# Altium schematic sheet LedMatrixPixelArray.SchDoc
size A4
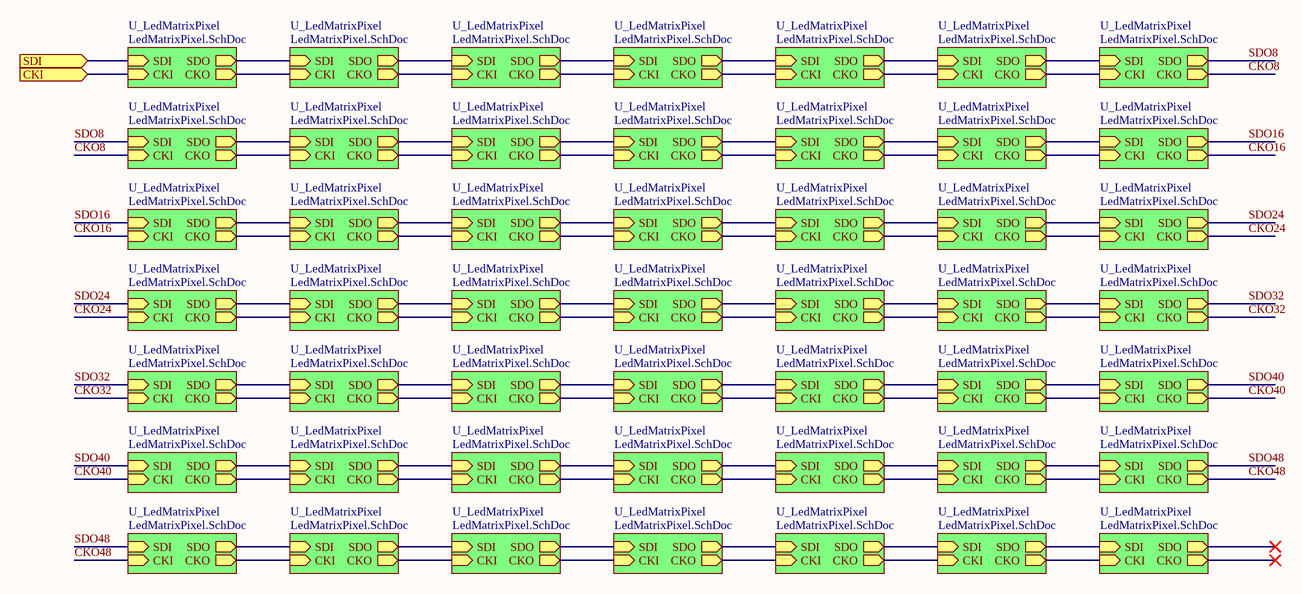
[diagram p0: LedMatrixPixelArray.SchDoc]

## Sub-sheets
U_LedMatrixPixel = LedMatrixPixel.SchDoc: SDI (in), CKI (in), SDO (out), CKO (out)
U_LedMatrixPixel = LedMatrixPixel.SchDoc: SDI (in), CKI (in), SDO (out), CKO (out)
U_LedMatrixPixel = LedMatrixPixel.SchDoc: SDI (in), CKI (in), SDO (out), CKO (out)
U_LedMatrixPixel = LedMatrixPixel.SchDoc: SDI (in), CKI (in), SDO (out), CKO (out)
U_LedMatrixPixel = LedMatrixPixel.SchDoc: SDI (in), CKI (in), SDO (out), CKO (out)
U_LedMatrixPixel = LedMatrixPixel.SchDoc: SDI (in), CKI (in), SDO (out), CKO (out)
U_LedMatrixPixel = LedMatrixPixel.SchDoc: SDI (in), CKI (in), SDO (out), CKO (out)
U_LedMatrixPixel = LedMatrixPixel.SchDoc: SDI (in), CKI (in), SDO (out), CKO (out)
U_LedMatrixPixel = LedMatrixPixel.SchDoc: SDI (in), CKI (in), SDO (out), CKO (out)
U_LedMatrixPixel = LedMatrixPixel.SchDoc: SDI (in), CKI (in), SDO (out), CKO (out)
U_LedMatrixPixel = LedMatrixPixel.SchDoc: SDI (in), CKI (in), SDO (out), CKO (out)
U_LedMatrixPixel = LedMatrixPixel.SchDoc: SDI (in), CKI (in), SDO (out), CKO (out)
U_LedMatrixPixel = LedMatrixPixel.SchDoc: SDI (in), CKI (in), SDO (out), CKO (out)
U_LedMatrixPixel = LedMatrixPixel.SchDoc: SDI (in), CKI (in), SDO (out), CKO (out)
U_LedMatrixPixel = LedMatrixPixel.SchDoc: SDI (in), CKI (in), SDO (out), CKO (out)
U_LedMatrixPixel = LedMatrixPixel.SchDoc: SDI (in), CKI (in), SDO (out), CKO (out)
U_LedMatrixPixel = LedMatrixPixel.SchDoc: SDI (in), CKI (in), SDO (out), CKO (out)
U_LedMatrixPixel = LedMatrixPixel.SchDoc: SDI (in), CKI (in), SDO (out), CKO (out)
U_LedMatrixPixel = LedMatrixPixel.SchDoc: SDI (in), CKI (in), SDO (out), CKO (out)
U_LedMatrixPixel = LedMatrixPixel.SchDoc: SDI (in), CKI (in), SDO (out), CKO (out)
U_LedMatrixPixel = LedMatrixPixel.SchDoc: SDI (in), CKI (in), SDO (out), CKO (out)
U_LedMatrixPixel = LedMatrixPixel.SchDoc: SDI (in), CKI (in), SDO (out), CKO (out)
U_LedMatrixPixel = LedMatrixPixel.SchDoc: SDI (in), CKI (in), SDO (out), CKO (out)
U_LedMatrixPixel = LedMatrixPixel.SchDoc: SDI (in), CKI (in), SDO (out), CKO (out)
U_LedMatrixPixel = LedMatrixPixel.SchDoc: SDI (in), CKI (in), SDO (out), CKO (out)
U_LedMatrixPixel = LedMatrixPixel.SchDoc: SDI (in), CKI (in), SDO (out), CKO (out)
U_LedMatrixPixel = LedMatrixPixel.SchDoc: SDI (in), CKI (in), SDO (out), CKO (out)
U_LedMatrixPixel = LedMatrixPixel.SchDoc: SDI (in), CKI (in), SDO (out), CKO (out)
U_LedMatrixPixel = LedMatrixPixel.SchDoc: SDI (in), CKI (in), SDO (out), CKO (out)
U_LedMatrixPixel = LedMatrixPixel.SchDoc: SDI (in), CKI (in), SDO (out), CKO (out)
U_LedMatrixPixel = LedMatrixPixel.SchDoc: SDI (in), CKI (in), SDO (out), CKO (out)
U_LedMatrixPixel = LedMatrixPixel.SchDoc: SDI (in), CKI (in), SDO (out), CKO (out)
U_LedMatrixPixel = LedMatrixPixel.SchDoc: SDI (in), CKI (in), SDO (out), CKO (out)
U_LedMatrixPixel = LedMatrixPixel.SchDoc: SDI (in), CKI (in), SDO (out), CKO (out)
U_LedMatrixPixel = LedMatrixPixel.SchDoc: SDI (in), CKI (in), SDO (out), CKO (out)
U_LedMatrixPixel = LedMatrixPixel.SchDoc: SDI (in), CKI (in), SDO (out), CKO (out)
U_LedMatrixPixel = LedMatrixPixel.SchDoc: SDI (in), CKI (in), SDO (out), CKO (out)
U_LedMatrixPixel = LedMatrixPixel.SchDoc: SDI (in), CKI (in), SDO (out), CKO (out)
U_LedMatrixPixel = LedMatrixPixel.SchDoc: SDI (in), CKI (in), SDO (out), CKO (out)
U_LedMatrixPixel = LedMatrixPixel.SchDoc: SDI (in), CKI (in), SDO (out), CKO (out)
U_LedMatrixPixel = LedMatrixPixel.SchDoc: SDI (in), CKI (in), SDO (out), CKO (out)
U_LedMatrixPixel = LedMatrixPixel.SchDoc: SDI (in), CKI (in), SDO (out), CKO (out)
U_LedMatrixPixel = LedMatrixPixel.SchDoc: SDI (in), CKI (in), SDO (out), CKO (out)
U_LedMatrixPixel = LedMatrixPixel.SchDoc: SDI (in), CKI (in), SDO (out), CKO (out)
U_LedMatrixPixel = LedMatrixPixel.SchDoc: SDI (in), CKI (in), SDO (out), CKO (out)
U_LedMatrixPixel = LedMatrixPixel.SchDoc: SDI (in), CKI (in), SDO (out), CKO (out)
U_LedMatrixPixel = LedMatrixPixel.SchDoc: SDI (in), CKI (in), SDO (out), CKO (out)
U_LedMatrixPixel = LedMatrixPixel.SchDoc: SDI (in), CKI (in), SDO (out), CKO (out)
U_LedMatrixPixel = LedMatrixPixel.SchDoc: SDI (in), CKI (in), SDO (out), CKO (out)

## Ports
CKI (in), SDI (in)

## Nets
CKI: port CKI, sheet U_LedMatrixPixel/CKI
CKO8: sheet U_LedMatrixPixel/CKI, sheet U_LedMatrixPixel/CKO
CKO16: sheet U_LedMatrixPixel/CKI, sheet U_LedMatrixPixel/CKO
CKO24: sheet U_LedMatrixPixel/CKI, sheet U_LedMatrixPixel/CKO
CKO32: sheet U_LedMatrixPixel/CKI, sheet U_LedMatrixPixel/CKO
CKO40: sheet U_LedMatrixPixel/CKI, sheet U_LedMatrixPixel/CKO
CKO48: sheet U_LedMatrixPixel/CKI, sheet U_LedMatrixPixel/CKO
SDI: port SDI, sheet U_LedMatrixPixel/SDI
SDO8: sheet U_LedMatrixPixel/SDI, sheet U_LedMatrixPixel/SDO
SDO16: sheet U_LedMatrixPixel/SDI, sheet U_LedMatrixPixel/SDO
SDO24: sheet U_LedMatrixPixel/SDI, sheet U_LedMatrixPixel/SDO
SDO32: sheet U_LedMatrixPixel/SDI, sheet U_LedMatrixPixel/SDO
SDO40: sheet U_LedMatrixPixel/SDI, sheet U_LedMatrixPixel/SDO
SDO48: sheet U_LedMatrixPixel/SDI, sheet U_LedMatrixPixel/SDO
(unnamed): sheet U_LedMatrixPixel/SDO, sheet U_LedMatrixPixel/SDI
(unnamed): sheet U_LedMatrixPixel/CKO, sheet U_LedMatrixPixel/CKI
(unnamed): sheet U_LedMatrixPixel/SDO, sheet U_LedMatrixPixel/SDI
(unnamed): sheet U_LedMatrixPixel/CKO, sheet U_LedMatrixPixel/CKI
(unnamed): sheet U_LedMatrixPixel/SDO, sheet U_LedMatrixPixel/SDI
(unnamed): sheet U_LedMatrixPixel/CKO, sheet U_LedMatrixPixel/CKI
(unnamed): sheet U_LedMatrixPixel/SDO, sheet U_LedMatrixPixel/SDI
(unnamed): sheet U_LedMatrixPixel/CKO, sheet U_LedMatrixPixel/CKI
(unnamed): sheet U_LedMatrixPixel/SDO, sheet U_LedMatrixPixel/SDI
(unnamed): sheet U_LedMatrixPixel/CKO, sheet U_LedMatrixPixel/CKI
(unnamed): sheet U_LedMatrixPixel/SDO, sheet U_LedMatrixPixel/SDI
(unnamed): sheet U_LedMatrixPixel/CKO, sheet U_LedMatrixPixel/CKI
(unnamed): sheet U_LedMatrixPixel/SDO, sheet U_LedMatrixPixel/SDI
(unnamed): sheet U_LedMatrixPixel/CKO, sheet U_LedMatrixPixel/CKI
(unnamed): sheet U_LedMatrixPixel/SDO, sheet U_LedMatrixPixel/SDI
(unnamed): sheet U_LedMatrixPixel/CKO, sheet U_LedMatrixPixel/CKI
(unnamed): sheet U_LedMatrixPixel/SDO, sheet U_LedMatrixPixel/SDI
(unnamed): sheet U_LedMatrixPixel/CKO, sheet U_LedMatrixPixel/CKI
(unnamed): sheet U_LedMatrixPixel/SDO, sheet U_LedMatrixPixel/SDI
(unnamed): sheet U_LedMatrixPixel/CKO, sheet U_LedMatrixPixel/CKI
(unnamed): sheet U_LedMatrixPixel/SDO, sheet U_LedMatrixPixel/SDI
(unnamed): sheet U_LedMatrixPixel/CKO, sheet U_LedMatrixPixel/CKI
(unnamed): sheet U_LedMatrixPixel/SDO, sheet U_LedMatrixPixel/SDI
(unnamed): sheet U_LedMatrixPixel/CKO, sheet U_LedMatrixPixel/CKI
(unnamed): sheet U_LedMatrixPixel/SDO, sheet U_LedMatrixPixel/SDI
(unnamed): sheet U_LedMatrixPixel/CKO, sheet U_LedMatrixPixel/CKI
(unnamed): sheet U_LedMatrixPixel/SDO, sheet U_LedMatrixPixel/SDI
(unnamed): sheet U_LedMatrixPixel/CKO, sheet U_LedMatrixPixel/CKI
(unnamed): sheet U_LedMatrixPixel/SDO, sheet U_LedMatrixPixel/SDI
(unnamed): sheet U_LedMatrixPixel/CKO, sheet U_LedMatrixPixel/CKI
(unnamed): sheet U_LedMatrixPixel/SDO, sheet U_LedMatrixPixel/SDI
(unnamed): sheet U_LedMatrixPixel/CKO, sheet U_LedMatrixPixel/CKI
(unnamed): sheet U_LedMatrixPixel/SDO, sheet U_LedMatrixPixel/SDI
(unnamed): sheet U_LedMatrixPixel/CKO, sheet U_LedMatrixPixel/CKI
(unnamed): sheet U_LedMatrixPixel/SDO, sheet U_LedMatrixPixel/SDI
(unnamed): sheet U_LedMatrixPixel/CKO, sheet U_LedMatrixPixel/CKI
(unnamed): sheet U_LedMatrixPixel/SDO, sheet U_LedMatrixPixel/SDI
(unnamed): sheet U_LedMatrixPixel/CKO, sheet U_LedMatrixPixel/CKI
(unnamed): sheet U_LedMatrixPixel/SDO, sheet U_LedMatrixPixel/SDI
(unnamed): sheet U_LedMatrixPixel/CKO, sheet U_LedMatrixPixel/CKI
(unnamed): sheet U_LedMatrixPixel/SDO, sheet U_LedMatrixPixel/SDI
(unnamed): sheet U_LedMatrixPixel/CKO, sheet U_LedMatrixPixel/CKI
(unnamed): sheet U_LedMatrixPixel/SDO, sheet U_LedMatrixPixel/SDI
(unnamed): sheet U_LedMatrixPixel/CKO, sheet U_LedMatrixPixel/CKI
(unnamed): sheet U_LedMatrixPixel/SDO, sheet U_LedMatrixPixel/SDI
(unnamed): sheet U_LedMatrixPixel/CKO, sheet U_LedMatrixPixel/CKI
(unnamed): sheet U_LedMatrixPixel/SDO, sheet U_LedMatrixPixel/SDI
(unnamed): sheet U_LedMatrixPixel/CKO, sheet U_LedMatrixPixel/CKI
(unnamed): sheet U_LedMatrixPixel/SDO, sheet U_LedMatrixPixel/SDI
(unnamed): sheet U_LedMatrixPixel/CKO, sheet U_LedMatrixPixel/CKI
(unnamed): sheet U_LedMatrixPixel/SDO, sheet U_LedMatrixPixel/SDI
(unnamed): sheet U_LedMatrixPixel/CKO, sheet U_LedMatrixPixel/CKI
(unnamed): sheet U_LedMatrixPixel/SDO, sheet U_LedMatrixPixel/SDI
(unnamed): sheet U_LedMatrixPixel/CKO, sheet U_LedMatrixPixel/CKI
(unnamed): sheet U_LedMatrixPixel/SDO, sheet U_LedMatrixPixel/SDI
(unnamed): sheet U_LedMatrixPixel/CKO, sheet U_LedMatrixPixel/CKI
(unnamed): sheet U_LedMatrixPixel/SDO, sheet U_LedMatrixPixel/SDI
(unnamed): sheet U_LedMatrixPixel/CKO, sheet U_LedMatrixPixel/CKI
(unnamed): sheet U_LedMatrixPixel/SDO, sheet U_LedMatrixPixel/SDI
(unnamed): sheet U_LedMatrixPixel/CKO, sheet U_LedMatrixPixel/CKI
(unnamed): sheet U_LedMatrixPixel/SDO, sheet U_LedMatrixPixel/SDI
(unnamed): sheet U_LedMatrixPixel/CKO, sheet U_LedMatrixPixel/CKI
(unnamed): sheet U_LedMatrixPixel/SDO, sheet U_LedMatrixPixel/SDI
(unnamed): sheet U_LedMatrixPixel/CKO, sheet U_LedMatrixPixel/CKI
(unnamed): sheet U_LedMatrixPixel/SDO, sheet U_LedMatrixPixel/SDI
(unnamed): sheet U_LedMatrixPixel/CKO, sheet U_LedMatrixPixel/CKI
(unnamed): sheet U_LedMatrixPixel/SDO, sheet U_LedMatrixPixel/SDI
(unnamed): sheet U_LedMatrixPixel/CKO, sheet U_LedMatrixPixel/CKI
(unnamed): sheet U_LedMatrixPixel/SDO, sheet U_LedMatrixPixel/SDI
(unnamed): sheet U_LedMatrixPixel/CKO, sheet U_LedMatrixPixel/CKI
(unnamed): sheet U_LedMatrixPixel/SDO, sheet U_LedMatrixPixel/SDI
(unnamed): sheet U_LedMatrixPixel/CKO, sheet U_LedMatrixPixel/CKI
(unnamed): sheet U_LedMatrixPixel/SDO, sheet U_LedMatrixPixel/SDI
(unnamed): sheet U_LedMatrixPixel/CKO, sheet U_LedMatrixPixel/CKI
(unnamed): sheet U_LedMatrixPixel/SDO, sheet U_LedMatrixPixel/SDI
(unnamed): sheet U_LedMatrixPixel/CKO, sheet U_LedMatrixPixel/CKI
(unnamed): sheet U_LedMatrixPixel/SDO, sheet U_LedMatrixPixel/SDI
(unnamed): sheet U_LedMatrixPixel/CKO, sheet U_LedMatrixPixel/CKI
(unnamed): sheet U_LedMatrixPixel/SDO, sheet U_LedMatrixPixel/SDI
(unnamed): sheet U_LedMatrixPixel/CKO, sheet U_LedMatrixPixel/CKI
(unnamed): sheet U_LedMatrixPixel/SDO, sheet U_LedMatrixPixel/SDI
(unnamed): sheet U_LedMatrixPixel/CKO, sheet U_LedMatrixPixel/CKI
(unnamed): sheet U_LedMatrixPixel/SDO, sheet U_LedMatrixPixel/SDI
(unnamed): sheet U_LedMatrixPixel/CKO, sheet U_LedMatrixPixel/CKI